# Altium schematic sheet USB HUB.SchDoc: USB HUB 1X4
size A3; Engineer: M.GUENI; Revision: R0; SheetNumber: 07; SheetTotal: 10
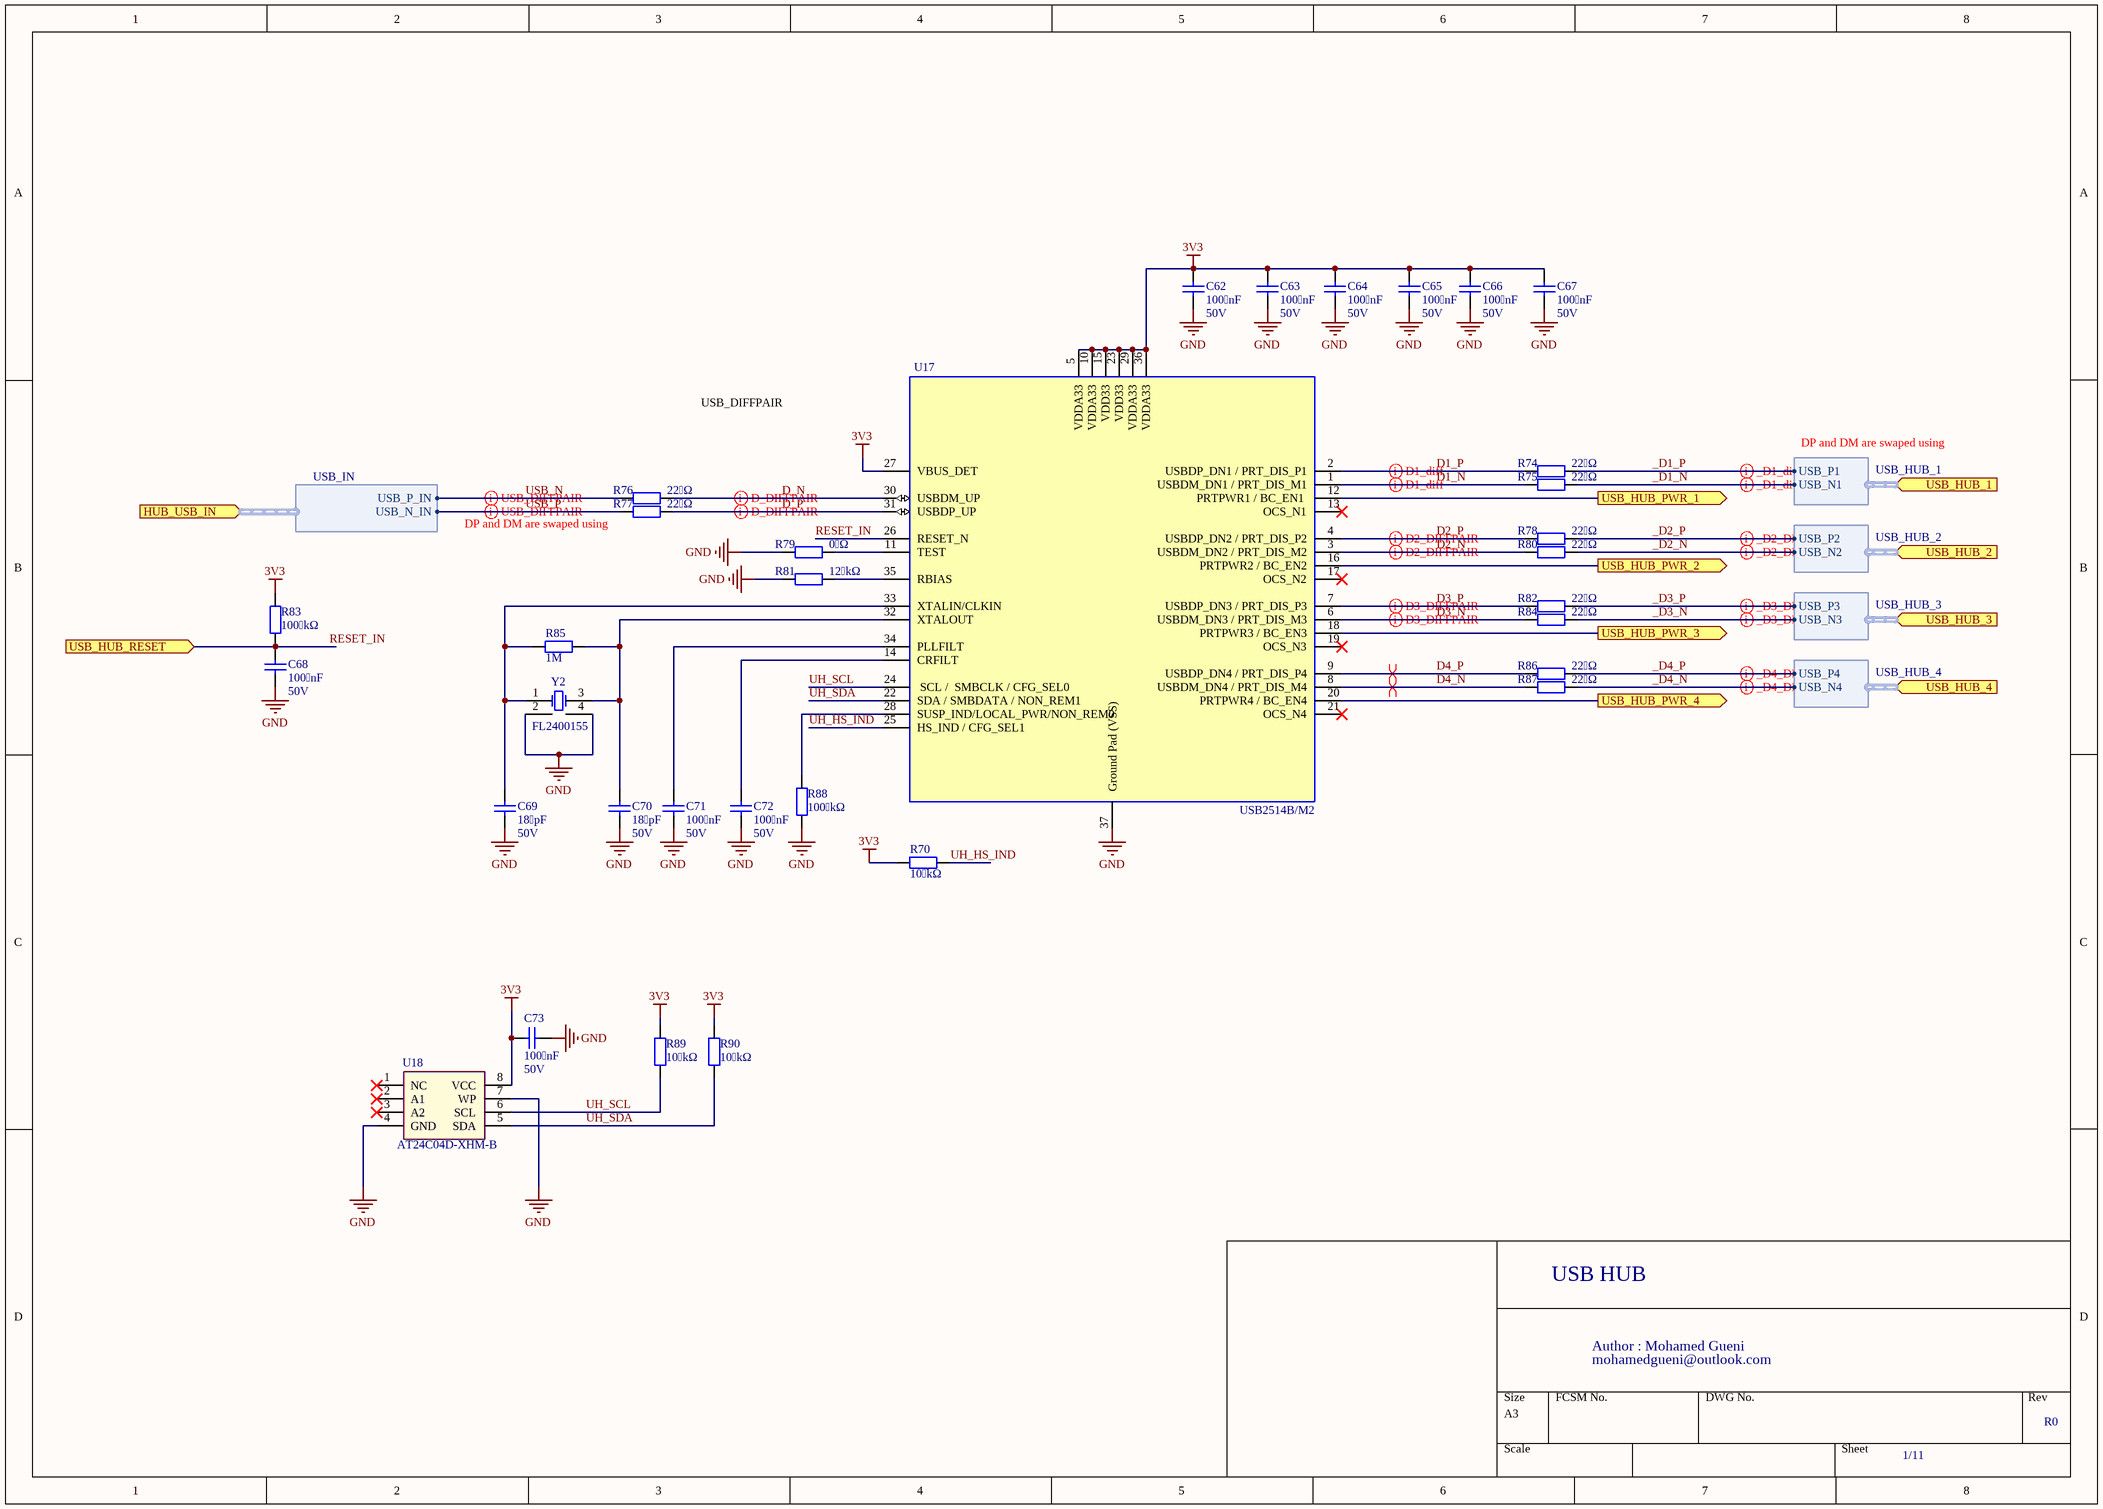
[diagram p0: USB HUB.SchDoc]

## Parts
C62  Value 1: 100 nF  Value 2: 50V  [CAPC1608N]  (hidden comment: GRM188R71H104KA93D)
C63  Value 1: 100 nF  Value 2: 50V  [CAPC1608N]  (hidden comment: GRM188R71H104KA93D)
C64  Value 1: 100 nF  Value 2: 50V  [CAPC1608N]  (hidden comment: GRM188R71H104KA93D)
C65  Value 1: 100 nF  Value 2: 50V  [CAPC1608N]  (hidden comment: GRM188R71H104KA93D)
C66  Value 1: 100 nF  Value 2: 50V  [CAPC1608N]  (hidden comment: GRM188R71H104KA93D)
C67  Value 1: 100 nF  Value 2: 50V  [CAPC1608N]  (hidden comment: GRM188R71H104KA93D)
C68  Value 1: 100 nF  Value 2: 50V  [CAPC1608N]  (hidden comment: GRM188R71H104KA93D)
C69  Value 1: 18 pF  Value 2: 50V  [CAPC1608N]  (hidden comment: GRM1885C1H180JA01D)
C70  Value 1: 18 pF  Value 2: 50V  [CAPC1608N]  (hidden comment: GRM1885C1H180JA01D)
C71  Value 1: 100 nF  Value 2: 50V  [CAPC1608N]  (hidden comment: GRM188R71H104KA93D)
C72  Value 1: 100 nF  Value 2: 50V  [CAPC1608N]  (hidden comment: GRM188R71H104KA93D)
C73  Value 1: 100 nF  Value 2: 50V  [CAPC1608N]  (hidden comment: GRM188R71H104KA93D)
R70  Value 1: 10 kΩ  [RESC1608N]  (hidden comment: CPF0603B10KE)
R74  Value 1: 22 Ω  [RESC1608N]  (hidden comment: ERJ-3EKF22R0V)
R75  Value 1: 22 Ω  [RESC1608N]  (hidden comment: ERJ-3EKF22R0V)
R76  Value 1: 22 Ω  [RESC1608N]  (hidden comment: ERJ-3EKF22R0V)
R77  Value 1: 22 Ω  [RESC1608N]  (hidden comment: ERJ-3EKF22R0V)
R78  Value 1: 22 Ω  [RESC1608N]  (hidden comment: ERJ-3EKF22R0V)
R79  Value 1: 0 Ω  [RESC1608N]  (hidden comment: RMCF0603ZT0R00)
R80  Value 1: 22 Ω  [RESC1608N]  (hidden comment: ERJ-3EKF22R0V)
R81  Value 1: 12 kΩ  [RESC1608N]  (hidden comment: ERJ-3EKF1202V)
R82  Value 1: 22 Ω  [RESC1608N]  (hidden comment: ERJ-3EKF22R0V)
R83  Value 1: 100 kΩ  [RESC1608N]  (hidden comment: TNPW0603100KBEA)
R84  Value 1: 22 Ω  [RESC1608N]  (hidden comment: ERJ-3EKF22R0V)
R85  Value 1: 1M  [RESC1608N]
R86  Value 1: 22 Ω  [RESC1608N]  (hidden comment: ERJ-3EKF22R0V)
R87  Value 1: 22 Ω  [RESC1608N]  (hidden comment: ERJ-3EKF22R0V)
R88  Value 1: 100 kΩ  [RESC1608N]  (hidden comment: TNPW0603100KBEA)
R89  Value 1: 10 kΩ  [RESC1608N]  (hidden comment: CPF0603B10KE)
R90  Value 1: 10 kΩ  [RESC1608N]  (hidden comment: CPF0603B10KE)
U17  USB2514B/M2  [SQFN-36]
U18  AT24C04D-XHM-B  [TSSOP-8AT24C04D-XHM-B]
Y2  FL2400155  [FL2400155]

## Ports
HUB_USB_IN (in, harness USB_IN), USB_HUB_1 (in, harness USB_HUB_1), USB_HUB_2 (in, harness USB_HUB_2), USB_HUB_3 (in, harness USB_HUB_3), USB_HUB_4 (in, harness USB_HUB_4), USB_HUB_PWR_1 (out), USB_HUB_PWR_2 (out), USB_HUB_PWR_3 (out), USB_HUB_PWR_4 (out), USB_HUB_RESET (in)

## Harnesses
USB_IN: USB_P_IN, USB_N_IN
USB_HUB_1: USB_N1, USB_P1
USB_HUB_2: USB_P2, USB_N2
USB_HUB_3: USB_P3, USB_N3
USB_HUB_4: USB_P4, USB_N4

## Nets
3V3: C62.2 C63.2 C64.2 C65.2 C66.2 C67.2 C73.2 R70.2 R83.1 R89.1 R90.1 U17.5(VDDA33) U17.10(VDDA33) U17.15(VDD33) U17.23(VDD33) U17.27(VBUS_DET) U17.29(VDDA33) U17.36(VDDA33) U18.8(VCC)
GND: C62.1 C63.1 C64.1 C65.1 C66.1 C67.1 C68.1 C69.1 C70.1 C71.1 C72.1 C73.1 R79.2 R81.2 R88.2 U17.37(Ground_Pad_(VSS)) U18.4(GND) U18.7(WP) Y2.2(Case1) Y2.4(Case2)
_D1_N: R75.1 ; port USB_HUB_1.USB_N1
_D1_P: R74.1 ; port USB_HUB_1.USB_P1
_D2_N: R80.1 ; port USB_HUB_2.USB_N2
_D2_P: R78.1 ; port USB_HUB_2.USB_P2
_D3_N: R84.1 ; port USB_HUB_3.USB_N3
_D3_P: R82.1 ; port USB_HUB_3.USB_P3
_D4_N: R87.1 ; port USB_HUB_4.USB_N4
_D4_P: R86.1 ; port USB_HUB_4.USB_P4
D1_N: R75.2 U17.1(USBDM_DN1_/_PRT_DIS_M1)
D1_P: R74.2 U17.2(USBDP_DN1_/_PRT_DIS_P1)
D2_N: R80.2 U17.3(USBDM_DN2_/_PRT_DIS_M2)
D2_P: R78.2 U17.4(USBDP_DN2_/_PRT_DIS_P2)
D3_N: R84.2 U17.6(USBDM_DN3_/_PRT_DIS_M3)
D3_P: R82.2 U17.7(USBDP_DN3_/_PRT_DIS_P3)
D4_N: R87.2 U17.8(USBDM_DN4_/_PRT_DIS_M4)
D4_P: R86.2 U17.9(USBDP_DN4_/_PRT_DIS_P4)
D_N: R76.1 U17.30(USBDM_UP)
D_P: R77.1 U17.31(USBDP_UP)
RESET_IN: C68.2 R83.2 U17.26(RESET_N) ; port USB_HUB_RESET
UH_HS_IND: R70.1 U17.25(HS_IND_/_CFG_SEL1)
UH_SCL: R89.2 U17.24(SCL_/__SMBCLK_/_CFG_SEL0) U18.6(SCL)
UH_SDA: R90.2 U17.22(SDA_/_SMBDATA_/_NON_REM1) U18.5(SDA)
USB_HUB_PWR_1: U17.12(PRTPWR1_/_BC_EN1) ; port USB_HUB_PWR_1
USB_HUB_PWR_2: U17.16(PRTPWR2_/_BC_EN2) ; port USB_HUB_PWR_2
USB_HUB_PWR_3: U17.18(PRTPWR3_/_BC_EN3) ; port USB_HUB_PWR_3
USB_HUB_PWR_4: U17.20(PRTPWR4_/_BC_EN4) ; port USB_HUB_PWR_4
USB_N: R76.2 ; port HUB_USB_IN.USB_P_IN
USB_P: R77.2 ; port HUB_USB_IN.USB_N_IN
NetC69_2: C69.2 R85.2 U17.33(XTALIN/CLKIN) Y2.1(OSC1)
NetC70_2: C70.2 R85.1 U17.32(XTALOUT) Y2.3
NetC71_2: C71.2 U17.34(PLLFILT)
NetC72_2: C72.2 U17.14(CRFILT)
NetR79_1: R79.1 U17.11(TEST)
NetR81_1: R81.1 U17.35(RBIAS)
NetR88_1: R88.1 U17.28(SUSP_IND/LOCAL_PWR/NON_REM0)

Not connected (* = marked no-connect by the designer): U17 13(OCS_N1)* 17(OCS_N2)* 19(OCS_N3)* 21(OCS_N4)*; U18 1(NC)* 2(A1)* 3(A2)*

## Layout directives
differential pair; differential pair class D_DIFFPAIR: D_N, D_P
differential pair; differential pair class USB_DIFFPAIR: USB_N, USB_P
differential pair; differential pair class D1_diff: D1_N, D1_P
differential pair; differential pair class D2_DIFFPAIR: D2_N, D2_P
differential pair; differential pair class _D2_DIFFPAIR: _D2_N, _D2_P
differential pair; differential pair class D3_DIFFPAIR: D3_N, D3_P
differential pair; differential pair class _D3_DIFFPAIR: _D3_N, _D3_P
differential pair: D4_N, D4_P
differential pair; differential pair class _D4_DIFFPAIR: _D4_N, _D4_P
differential pair; differential pair class _D1_diff: _D1_N, _D1_P

## Notes on the sheet
- USB_DIFFPAIR
- DP and DM are swaped using
- USB HUB
- Author : Mohamed Gueni
- mohamedgueni@outlook.com
- 1/11
- R0
- Title:
- Micro Device Tunisie
- Size:
- Date:
- File:
- A3
- Engineer :
- Revision:
- Sheet
- of
- Cyber Parc  Hammam Sousse
- Avenue Charles De Gaulle
- 4011, Hammam-Sousse, Tunisie
- contact@mdtunisie.com

## Library data of the parts
C62-C68 C71-C73 = CAP-000000017: MAN: Murata; DES: Ceramic Capacitor, 100 nF, 50V, X7R, 0603; FTP: 603; SUPREF: 81-GRM188R71H104KA93D; Part Number: CAP-000000017; MANREF: GRM188R71H104KA93D
C69 C70 = CAP-000000030: MAN: Murata; DES: Ceramic Capacitor, 18 pF, 50V, C0G, 0603; FTP: 603; SUPREF: 81-GRM1885C1H180JA01D; Part Number: CAP-000000030; MANREF: GRM1885C1H180JA01D
R70 R89 R90 = RES-0000000012: MAN: TE Connectivity; DES: Thin Film Resistor, 10 kΩ, 1%, 62.5 mW, 0603; TOL: 1%; FTP: 0603; SUP: Mouser; SUPREF: 279-CMF0603F1002FHEK; NOTE: _; Part Number: RES-0000000012; MANREF: CPF0603B10KE
R74-R78 R80 R82 R84 R86 R87 = RES-0000000019: MAN: Panasonic; DES: Thick Film Resistor, 22 Ω, 1%, 200 mW, 0603; TOL: 1%; FTP: 0603; SUP: Mouser; SUPREF: 667-ERJ-3EKF22R0V; NOTE: _; Part Number: RES-0000000019; MANREF: ERJ-3EKF22R0V
R79 = RES-0000000017: MAN: Stackpole Electronics; DES: Thick Film Resistor, 0 Ω (Jumper), 100 mW, 0603; TOL: 1%; FTP: 0603; SUP: Mouser; SUPREF: 71-CRCW06030000Z0EA; NOTE: _; Part Number: RES-0000000017; MANREF: RMCF0603ZT0R00
R81 = RES-0000000011: MAN: Panasonic; DES: Thick Film Resistor, 12 kΩ, 1%, 200 mW, 0603; TOL: 1%; FTP: 0603; SUP: Mouser; SUPREF: 667-ERJ-3EKF1202V; NOTE: _; Part Number: RES-0000000011; MANREF: ERJ-3EKF1202V
R83 R88 = RES-0000000013: MAN: Vishay / Dale; DES: Thin Film Resistor, 100 kΩ, 1%, 125 mW, 0603; TOL: 1%; FTP: 0603; SUP: Mouser; SUPREF: 71-CRCW0603100KFKEA; NOTE: _; Part Number: RES-0000000013; MANREF: TNPW0603100KBEA
R85 = RES-000000011: FTP: 0603; SUP: Mouser; NOTE: _; Part Number: RES-000000011
U17 = GIC-000000002: MAN: Microchip Technology; DES: USB Interface IC 4-Port USB 2.0 Hi-Speed Hub Cont; Value 1: 3.3 V; Value 2: 70 mA; TOL: _; SUP: Mouser; SUPREF: 579-USB2514B/M2; Part Number: GIC-000000002; MANREF: USB2514B/M2; FTP: SQFN-36; NOTE: _
U18 = GIC-000000011: MAN: Microchip Technology; DES: EEPROM 1.7-3.6V, 1MHz, Ind Tmp, 8-TSSOP; Value 1: 3.6 V; Value 2: _; FTP: TSSOP-8; SUP: Mouser; SUPREF: 556-AT24C04D-XHM-B; Part Number: GIC-000000011; MANREF: AT24C04D-XHM-B; TOL: _; NOTE: _
Y2 = Y-000000003: MAN: Diodes Incorporated; DES: Crystals Crystal Ceramic SEAM3225 T&R 3K; Value 1: 24 MHz; Value 2: 27 pF; TOL: 30 PPM; SUP: Mouser; SUPREF: 729-FL2400155; NOTE: _; Part Number: Y-000000003; MANREF: FL2400155